# Altium schematic sheet core.SchDoc
size A4
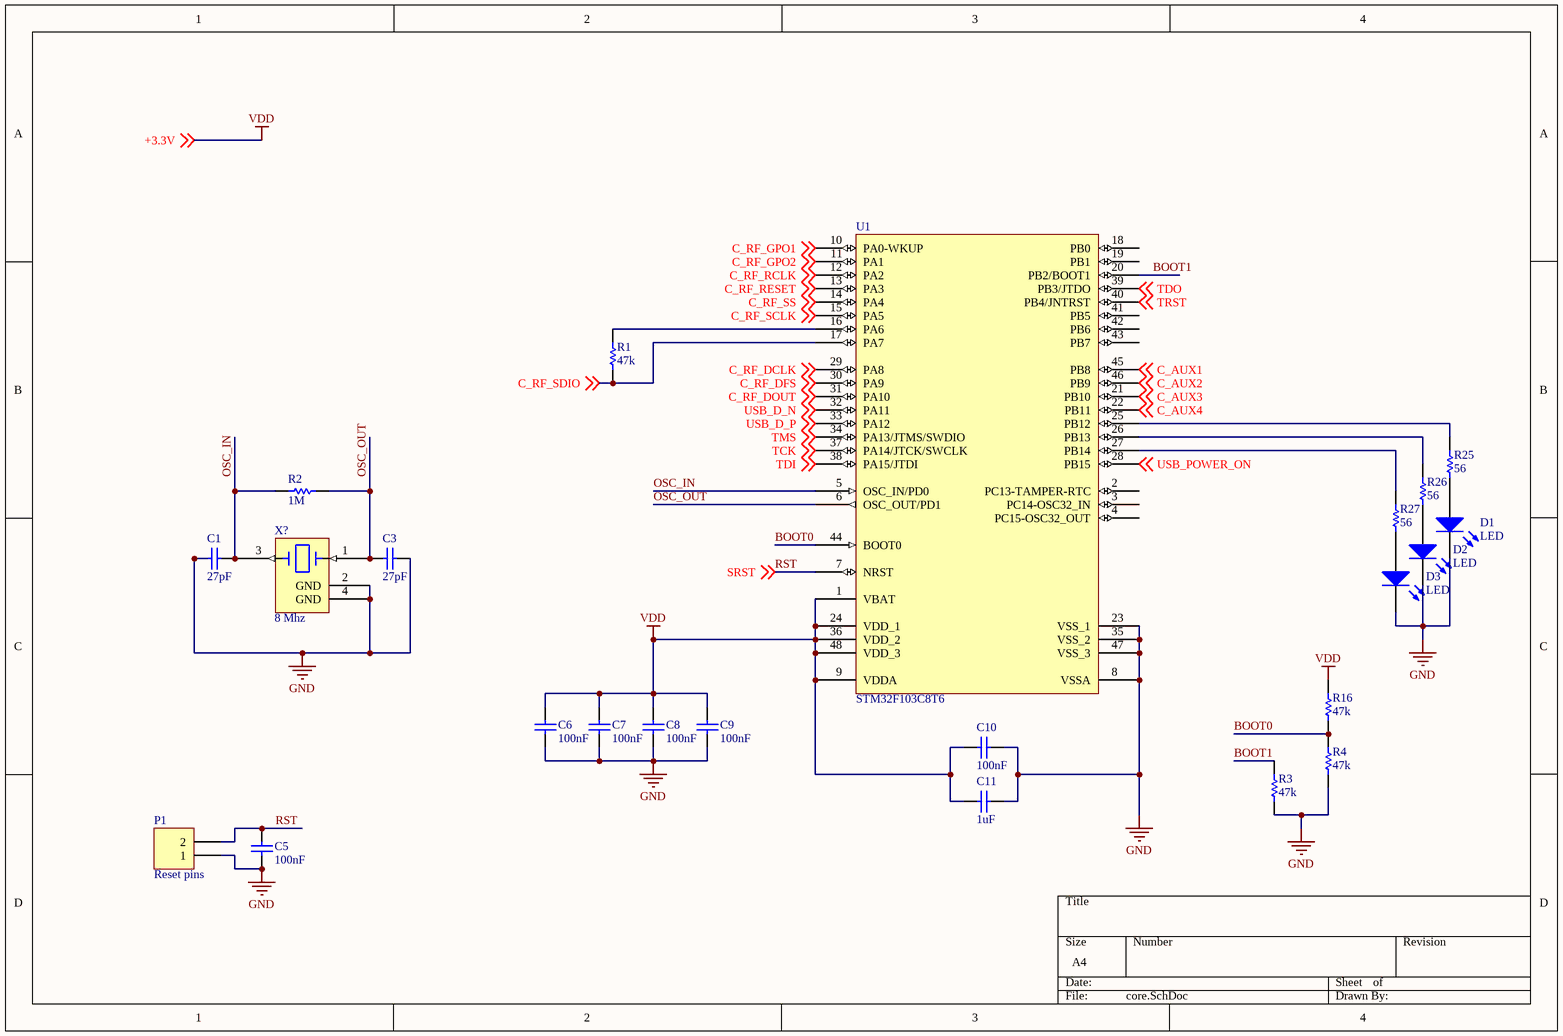
[diagram p0: core.SchDoc]

## Parts
C1  27pF  [CHIP0402]
C3  27pF  [CHIP0402]
C5  100nF  [CHIP0402]
C6  100nF  [CHIP0402]
C7  100nF  [CHIP0402]
C8  100nF  [CHIP0402]
C9  100nF  [CHIP0402]
C10  100nF  [CHIP0402]
C11  1uF  [CHIP0402]
D1  LED  [LEDC2015X11L]
D2  LED  [LEDC2015X11L]
D3  LED  [LEDC2015X11L]
P1  Reset pins  [MHDR1X2]
R1  47k  [CHIP0402]
R2  1M  [CHIP0402]
R3  47k  [CHIP0402]
R4  47k  [CHIP0402]
R16  47k  [CHIP0402]
R25  56  [CHIP0402]
R26  56  [CHIP0402]
R27  56  [CHIP0402]
U1  STM32F103C8T6  [LQFP48_N]
X?  8 Mhz  [SMD0635x11mm]

## Nets
GND: C1.2 C3.1 C5.1 C6.1 C7.1 C8.1 C9.1 C10.2 C11.2 D1.2(K) D2.2(K) D3.2(K) P1.1 R3.1 R4.1 U1.8(VSSA) U1.23(VSS_1) U1.35(VSS_2) U1.47(VSS_3) X?.2(GND) X?.4(GND)
VDD: C6.2 C7.2 C8.2 C9.2 C10.1 C11.1 R16.2 U1.1(VBAT) U1.9(VDDA) U1.24(VDD_1) U1.36(VDD_2) U1.48(VDD_3) ; off-sheet +3.3V  [also labelled +3.3V]
BOOT0: R4.2 R16.1 U1.44(BOOT0)
BOOT1: R3.2 U1.20(PB2/BOOT1)
C_AUX1: U1.45(PB8) ; off-sheet C_AUX1
C_AUX2: U1.46(PB9) ; off-sheet C_AUX2
C_AUX3: U1.21(PB10) ; off-sheet C_AUX3
C_AUX4: U1.22(PB11) ; off-sheet C_AUX4
C_RF_DCLK: U1.29(PA8) ; off-sheet C_RF_DCLK
C_RF_DFS: U1.30(PA9) ; off-sheet C_RF_DFS
C_RF_DOUT: U1.31(PA10) ; off-sheet C_RF_DOUT
C_RF_GPO1: U1.10(PA0-WKUP) ; off-sheet C_RF_GPO1
C_RF_GPO2: U1.11(PA1) ; off-sheet C_RF_GPO2
C_RF_RCLK: U1.12(PA2) ; off-sheet C_RF_RCLK
C_RF_RESET: U1.13(PA3) ; off-sheet C_RF_RESET
C_RF_SCLK: U1.15(PA5) ; off-sheet C_RF_SCLK
C_RF_SDIO: R1.2 U1.17(PA7) ; off-sheet C_RF_SDIO
C_RF_SS: U1.14(PA4) ; off-sheet C_RF_SS
OSC_IN: C1.1 R2.2 U1.5(OSC_IN/PD0) X?.3
OSC_OUT: C3.2 R2.1 U1.6(OSC_OUT/PD1) X?.1
RST: C5.2 P1.2 U1.7(NRST) ; off-sheet SRST  [also labelled SRST]
TCK: U1.37(PA14/JTCK/SWCLK) ; off-sheet TCK
TDI: U1.38(PA15/JTDI) ; off-sheet TDI
TDO: U1.39(PB3/JTDO) ; off-sheet TDO
TMS: U1.34(PA13/JTMS/SWDIO) ; off-sheet TMS
TRST: U1.40(PB4/JNTRST) ; off-sheet TRST
USB_D_N: U1.32(PA11) ; off-sheet USB_D_N
USB_D_P: U1.33(PA12) ; off-sheet USB_D_P
USB_POWER_ON: U1.28(PB15) ; off-sheet USB_POWER_ON
NetD1_1: D1.1(A) R25.2
NetD2_1: D2.1(A) R26.1
NetD3_1: D3.1(A) R27.1
NetR1_1: R1.1 U1.16(PA6)
NetR25_1: R25.1 U1.25(PB12)
NetR26_2: R26.2 U1.26(PB13)
NetR27_2: R27.2 U1.27(PB14)

Not connected (* = marked no-connect by the designer): U1 2(PC13-TAMPER-RTC) 3(PC14-OSC32_IN) 4(PC15-OSC32_OUT) 18(PB0) 19(PB1) 41(PB5) 42(PB6) 43(PB7)

## Library data of the parts
C1 C3 C5-C11 = Cap: Capacitor; Published: 8-Jun-2000; LatestRevisionDate: 17-Jul-2002; LatestRevisionNote: Re-released for DXP Platform.; PackageReference: RAD-0.3; Publisher: Altium Limited; PackageDescription: Radial Cap, Thru-Hole; 2 Leads; 0.3 in Pin Spacing
  C1 C3: Value: 27pF
  C5-C10: Value: 100nF
  C11: Value: 1uF
D1-D3 = LED: Typical RED, GREEN, YELLOW, AMBER GaAs LED; Published: 8-Jun-2000; LatestRevisionDate: 17-Jul-2002; LatestRevisionNote: Re-released for DXP Platform.; PackageVersion: Feb-2002; PackageReference: 3.2X1.6X1.1; Publisher: Altium Limited; PackageDescription: SM LED; 2 Flat Leads
P1 = MHDR1X2: Header, 2-Pin; LatestRevisionDate: 17-Jul-2002; LatestRevisionNote: Re-released for DXP Platform.; Publisher: Altium Limited
R1-R4 R16 R25-R27 = Res1: Resistor; Published: 8-Jun-2000; LatestRevisionDate: 17-Jul-2002; LatestRevisionNote: Re-released for DXP Platform.; PackageReference: AXIAL-0.3; Publisher: Altium Limited; PackageDescription: Axial Device, Thru-Hole; 2 Leads; 0.3 in Pin Spacing
  R1 R3 R4 R16: Value: 47k
  R2: Value: 1M
  R25-R27: Value: 56
U1 = STM32F103C8T6: STM32 ARM-based 32-bit MCU with 64 Kbytes Flash, 48-pin LQFP, Industrial Temperature; Published: 30-May-2008; DatasheetVersion: rev6, Mar-2008; PackageVersion: Mar-2008; PackageReference: LQFP48; Publisher: Altium Limited; PackageDescription: 48-Pin Low-Profile Quad Flat Pack, 7 x 7 mm Body, 0.5 mm Pitch (LQFP48); ComponentLink1Description: Manufacturer Link; ComponentLink1URL: www.st.com/stm32; ComponentLink2Description: Datasheet; ComponentLink2URL: http://www.st.com/stonline/products/literature/ds/13587.pdf
X? = SMD4025-8.000: Crystal; Value: 8 Mhz